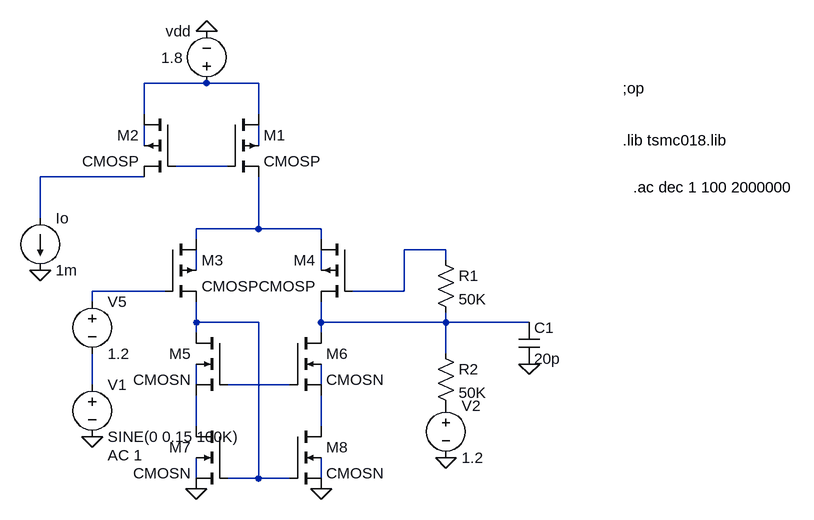
[diagram p0: schematic Draft2.asc]
Draft2.asc, the LTspice schematic file:
Version 4
SHEET 1 1000 680
WIRE 80 -32 -16 -32
WIRE 160 -32 80 -32
WIRE -16 16 -16 -32
WIRE 160 16 160 -32
WIRE -16 64 -16 32
WIRE 160 64 160 32
WIRE 112 96 32 96
WIRE -16 112 -176 112
WIRE -176 176 -176 112
WIRE 160 192 160 112
WIRE 160 192 64 192
WIRE 256 192 160 192
WIRE 64 208 64 192
WIRE 256 208 256 192
WIRE 448 224 384 224
WIRE 448 240 448 224
WIRE 64 256 64 224
WIRE 256 256 256 224
WIRE 16 288 -96 288
WIRE 384 288 384 224
WIRE 384 288 304 288
WIRE -96 304 -96 288
WIRE 64 336 64 304
WIRE 160 336 64 336
WIRE 256 336 256 304
WIRE 448 336 448 320
WIRE 448 336 256 336
WIRE 576 336 448 336
WIRE 64 352 64 336
WIRE 256 352 256 336
WIRE 448 384 448 336
WIRE -96 432 -96 384
WIRE 64 432 64 400
WIRE 208 432 112 432
WIRE 256 432 256 400
WIRE 64 496 64 448
WIRE 256 496 256 448
WIRE 64 576 64 544
WIRE 160 576 160 336
WIRE 160 576 112 576
WIRE 208 576 160 576
WIRE 256 576 256 544
FLAG -176 256 0
FLAG 80 -112 0
FLAG 64 592 0
FLAG 256 592 0
FLAG 576 400 0
FLAG -96 512 0
FLAG 448 544 0
DATAFLAG 48 96 ""
SYMBOL cmosp 112 16 R0
SYMATTR InstName M1
SYMATTR Value2 l=180nm w=360um
SYMBOL cmosp 32 16 M0
SYMATTR InstName M2
SYMATTR Value2 l=180nm w=360um
SYMBOL cmosp 16 208 R0
SYMATTR InstName M3
SYMATTR Value2 l=180nm w=360um
SYMBOL current -176 176 R0
WINDOW 123 0 0 Left 0
WINDOW 39 0 0 Left 0
SYMATTR InstName Io
SYMATTR Value 1m
SYMBOL voltage 80 -16 R180
WINDOW 0 24 96 Left 2
WINDOW 3 36 55 Left 2
WINDOW 123 0 0 Left 0
WINDOW 39 0 0 Left 0
SYMATTR InstName vdd
SYMATTR Value 1.8
SYMBOL voltage -96 288 R0
WINDOW 123 0 0 Left 0
WINDOW 39 0 0 Left 0
SYMATTR InstName V5
SYMATTR Value 1.2
SYMBOL cmosn 112 352 M0
SYMATTR InstName M5
SYMATTR Value2 l=180nm w=360um
SYMBOL cmosn 208 352 R0
SYMATTR InstName M6
SYMATTR Value2 l=180nm w=360um
SYMBOL cmosn 112 496 M0
SYMATTR InstName M7
SYMATTR Value2 l=180nm w=360um
SYMBOL cmosn 208 496 R0
SYMATTR InstName M8
SYMATTR Value2 l=180nm w=360um
SYMBOL cmosp 304 208 M0
SYMATTR InstName M4
SYMATTR Value2 l=180nm w=360um
SYMBOL res 432 224 R0
SYMATTR InstName R1
SYMATTR Value 50K
SYMBOL res 432 368 R0
SYMATTR InstName R2
SYMATTR Value 50K
SYMBOL cap 560 336 R0
SYMATTR InstName C1
SYMATTR Value 20p
SYMBOL voltage -96 416 R0
WINDOW 123 24 124 Left 2
WINDOW 39 0 0 Left 0
SYMATTR InstName V1
SYMATTR Value SINE(0 0.15 100K)
SYMATTR Value2 AC 1
SYMBOL voltage 448 448 R0
WINDOW 123 0 0 Left 0
WINDOW 39 0 0 Left 0
SYMATTR InstName V2
SYMATTR Value 1.2
TEXT 720 -24 Left 2 !;op
TEXT 720 56 Left 2 !.lib tsmc018.lib
TEXT 736 128 Left 2 !.ac dec 1 100 2000000

The netlist it stands for:
* Draft2.asc
M1 N001 N004 N006 N003 CMOSP l=180nm w=360um
M2 N001 N004 N005 N002 CMOSP l=180nm w=360um
M3 N006 N010 N011 N008 CMOSP l=180nm w=360um
Io N005 0 1m
vdd N001 0 1.8
V5 N010 N013 1.2
M5 N011 N015 N017 N014 CMOSN l=180nm w=360um
M6 N012 N015 N018 N016 CMOSN l=180nm w=360um
M7 N017 N011 0 N019 CMOSN l=180nm w=360um
M8 N018 N011 0 N020 CMOSN l=180nm w=360um
M4 N006 N007 N012 N009 CMOSP l=180nm w=360um
R1 N007 N012 50K
R2 N012 P001 50K
C1 N012 0 20p
V1 N013 0 SINE(0 0.15 100K) AC 1
V2 P001 0 1.2
.model NMOS NMOS
.model PMOS PMOS
.lib standard.mos
;op
.lib tsmc018.lib
.ac dec 1 100 2000000
.backanno
.end